# EAGLE board SPI_Test (EAGLE 9.6.2)
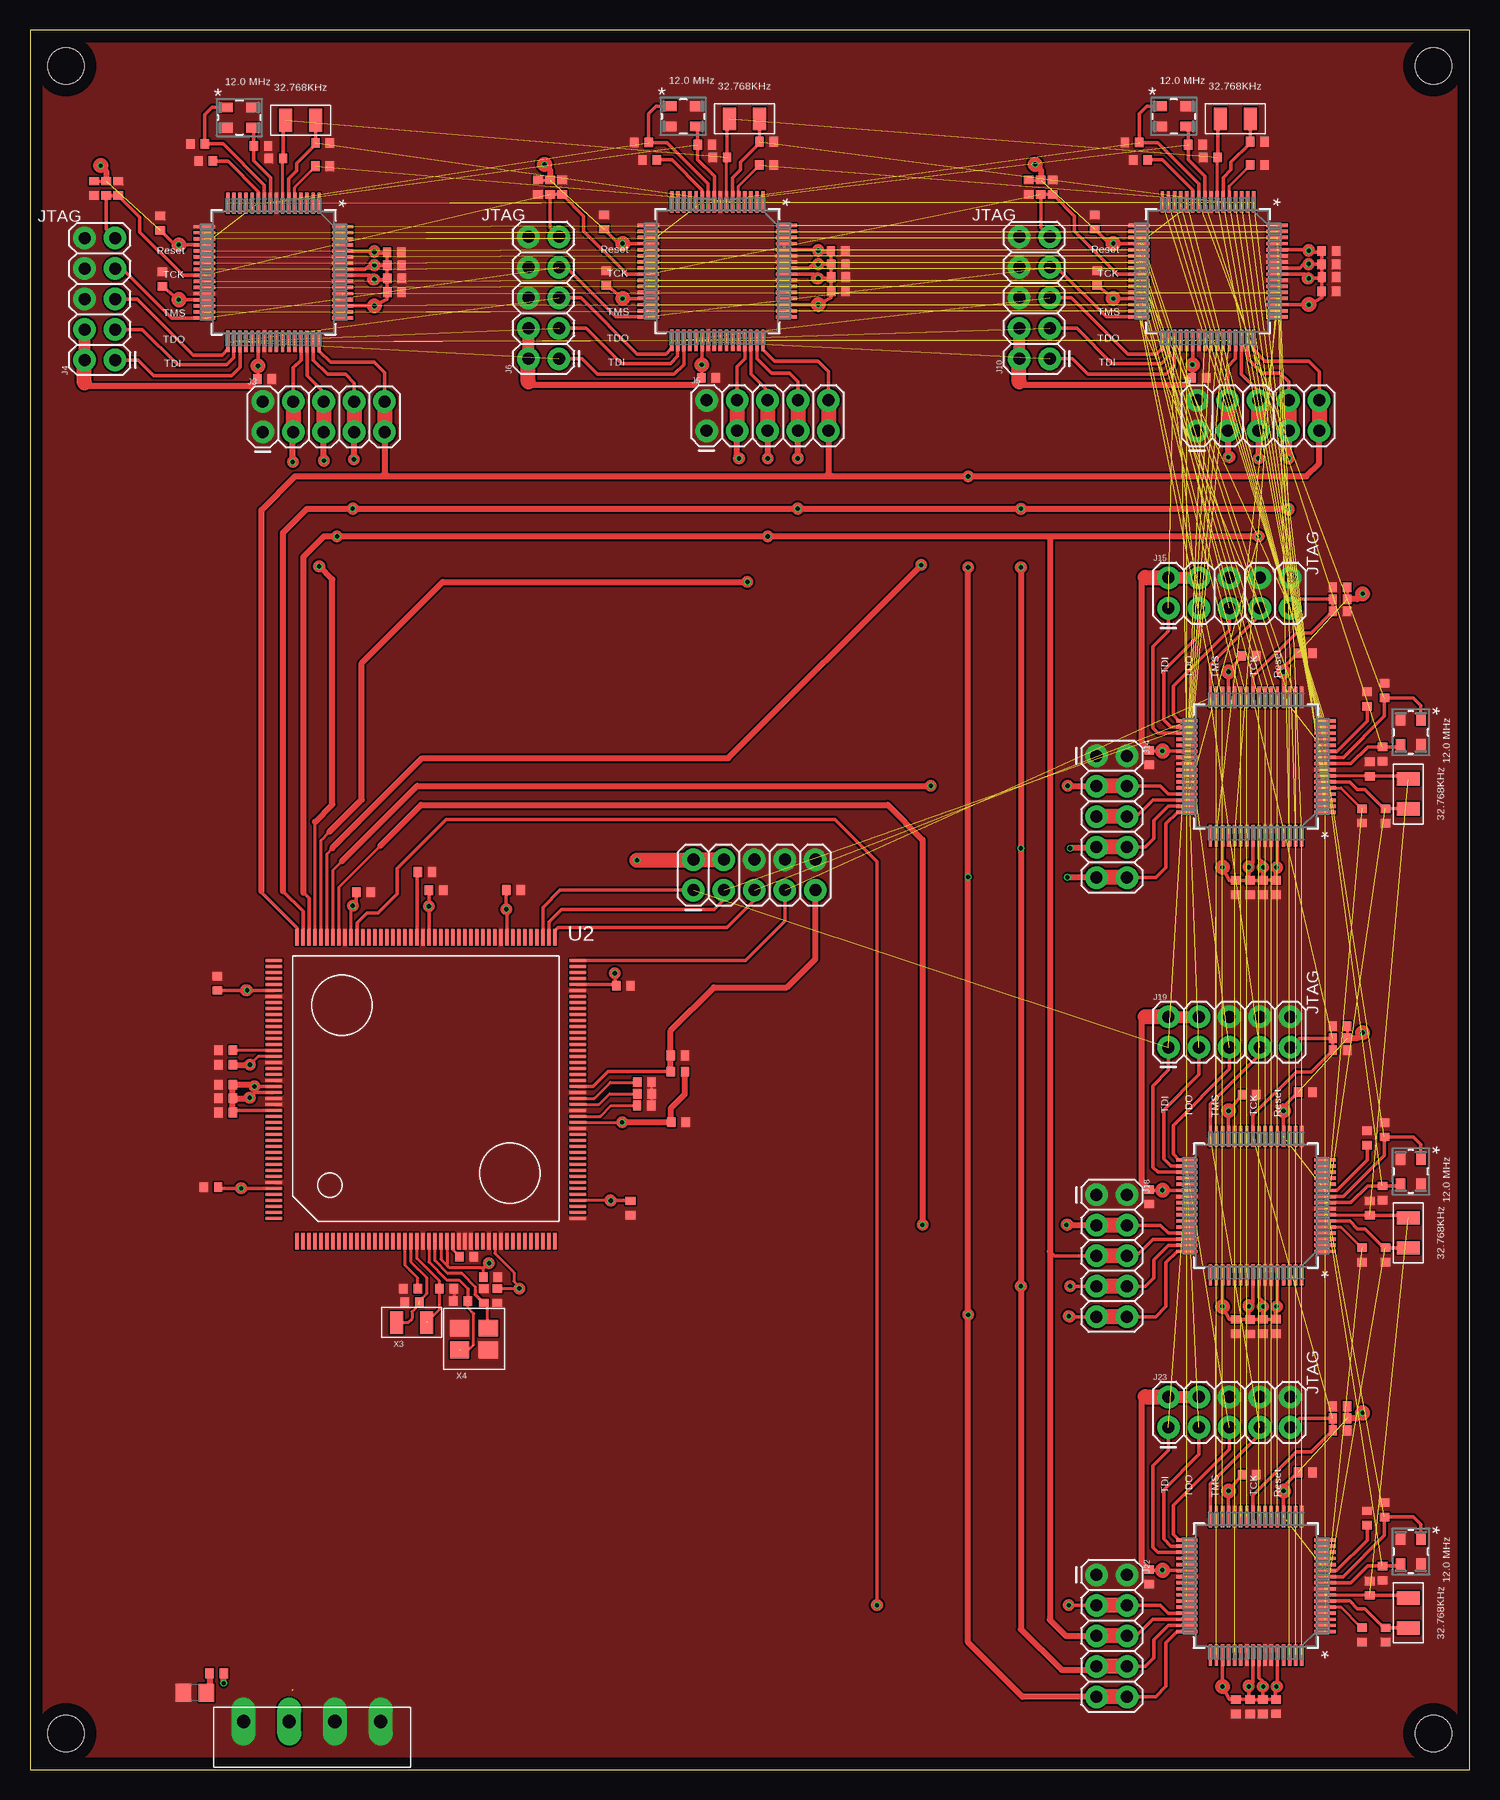
[diagram p6: board, top side]
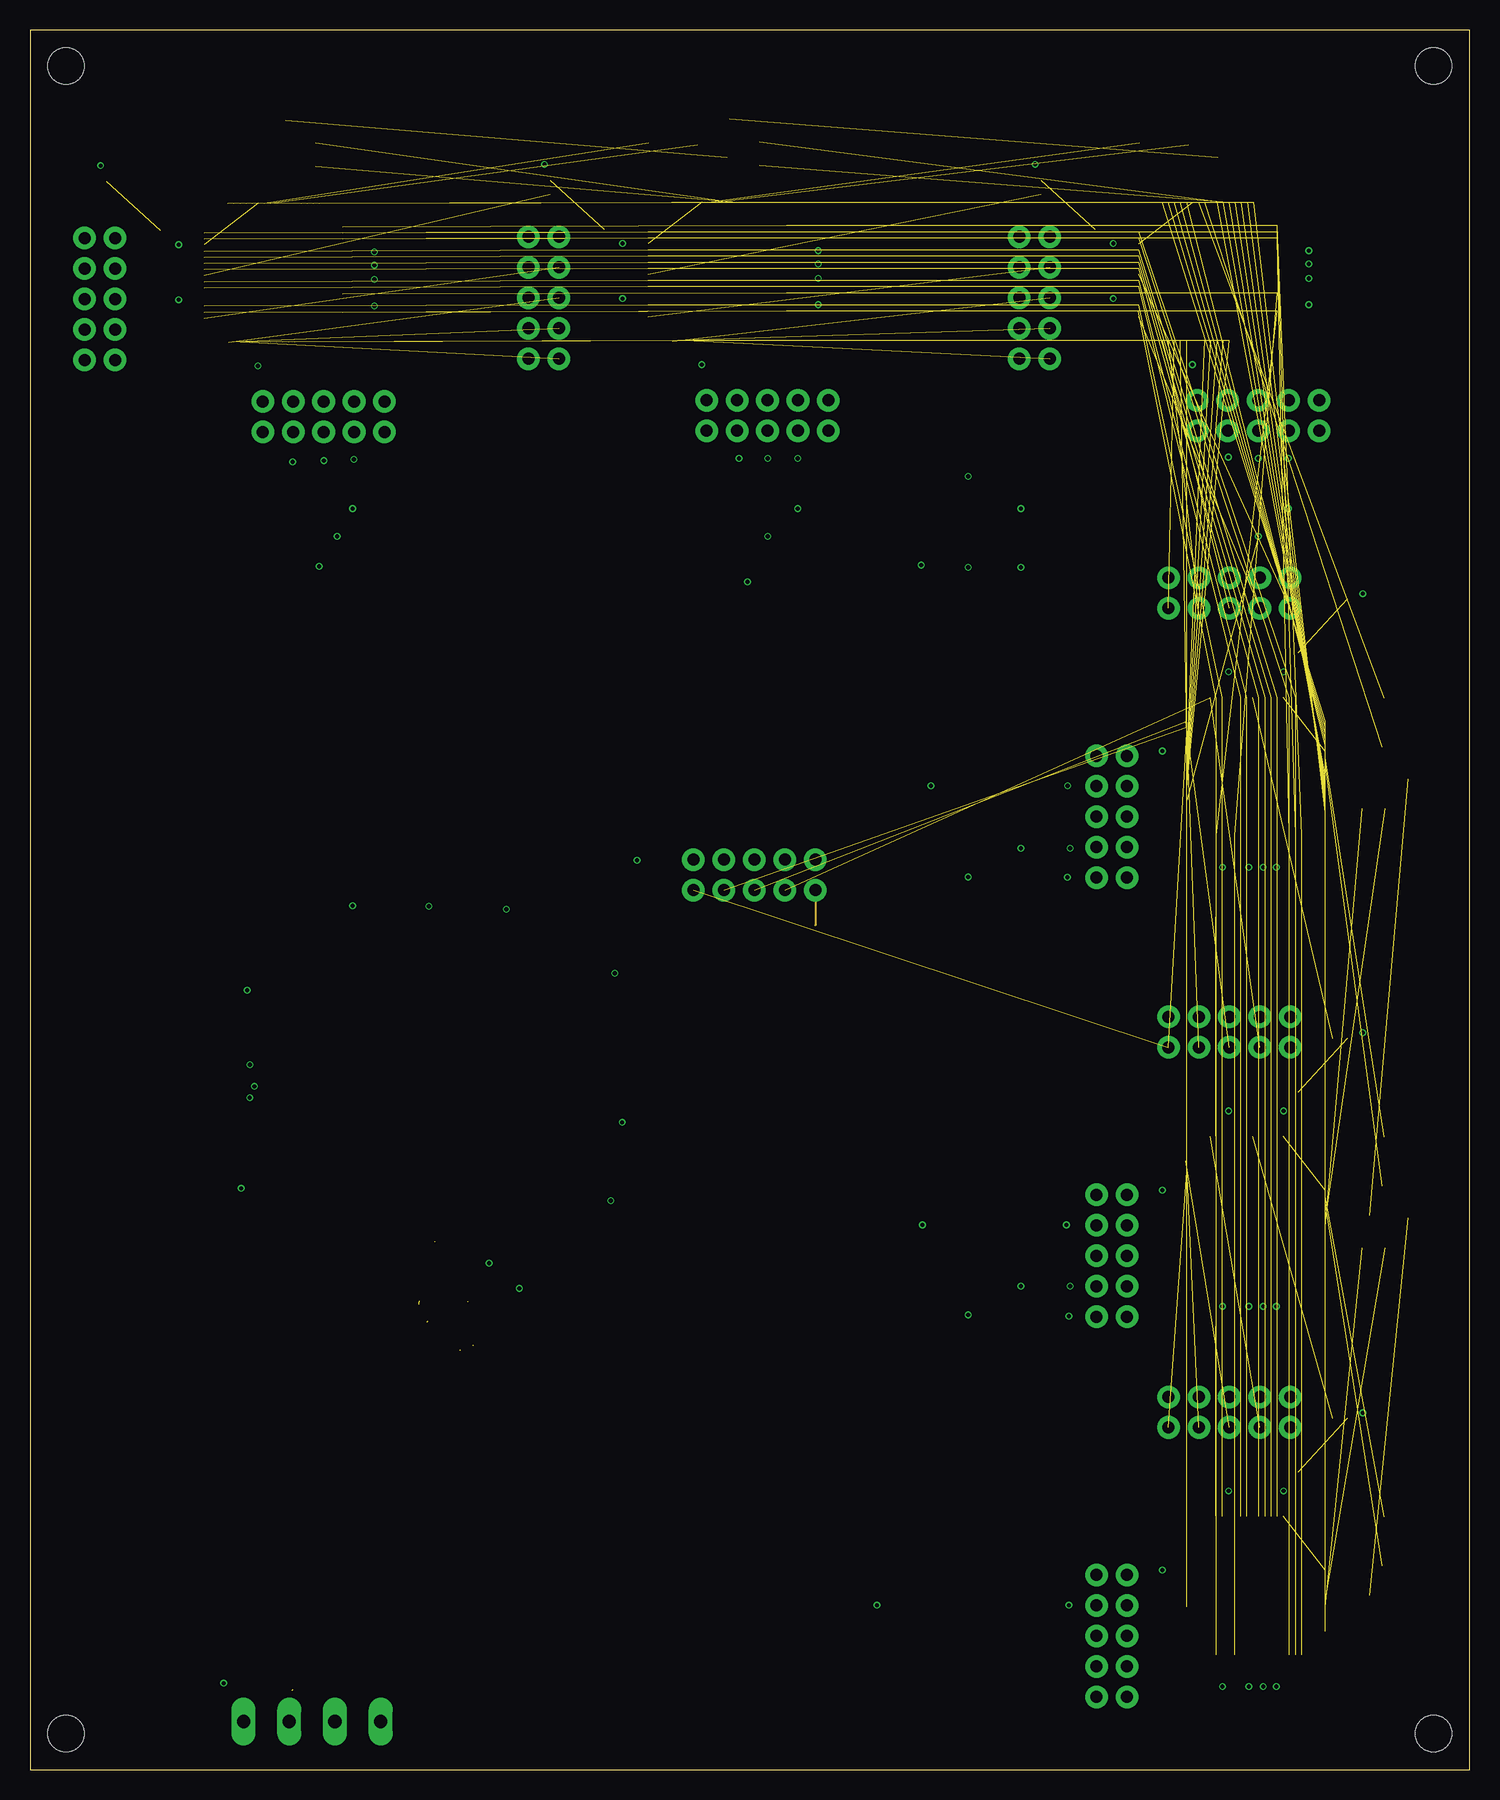
[diagram p7: board, inner layer Route3]
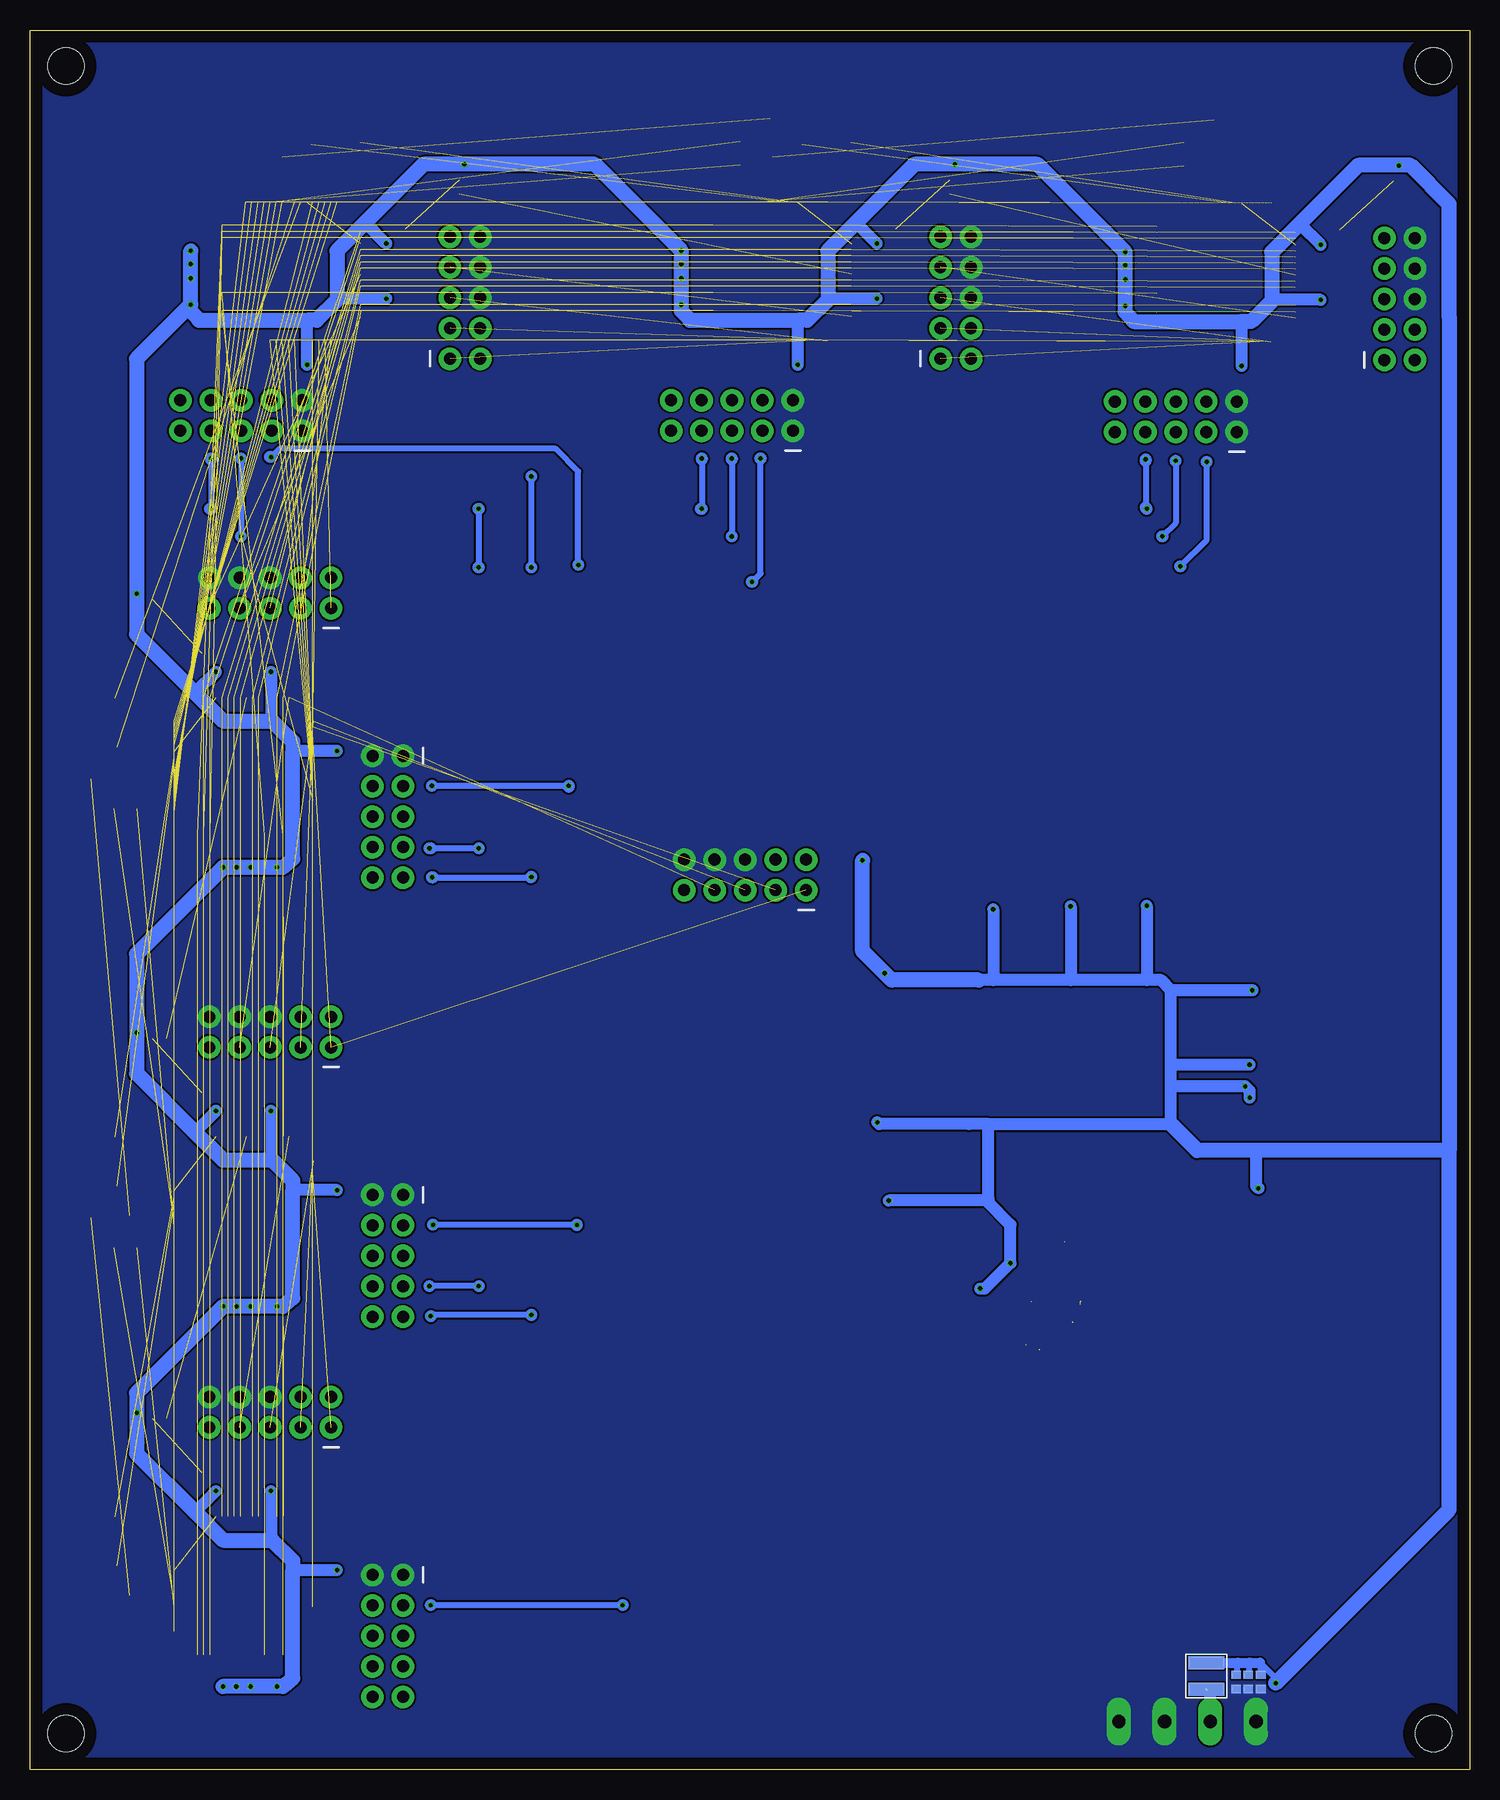
[diagram p8: board, bottom side, seen from below]

Size 120 x 145 mm. Coordinates in mm from the lower left corner, seen from the top.
Outline: 0,0 120,0 120,145 0,145 0,0
Copper layers (1*16): Top 0.035mm / dielectric 1.5mm / Bottom 0.035mm
Design rules "default": minimum track width 6mil, minimum drill 0.2mm, track to track 6mil, track to pad 6mil, pad to pad 6mil, via to via 6mil, smd to smd 6mil, copper to edge 40mil, drill to drill 6mil, minimum pad ring 10mil, minimum via ring 4mil, stop-mask expansion 4mil, vias tented up to drill 0mil, thermal gap 10mil
Holes 3 mm at 3,3 117,3 117,142 3,142

## Footprints (pad centres in the part's own frame; a part is rotated, then mirrored left to right if it is on the bottom)
0402 = smd 0.8 x 0.7: P$1 0,0.6; P$2 0,-0.6
2X5 = drill 1 pad 1.88: 1 0,0; 2 0,2.54; 3 2.54,0; 4 2.54,2.54; 5 5.08,0; 6 5.08,2.54; 7 7.62,0; 8 7.62,2.54; 9 10.16,0; 10 10.16,2.54
1X4_3.81MM_PITCH = drill 1.1 pad 2 long: P$1 0,0; P$2 3.81,0; P$3 7.62,0; P$4 11.43,0
1008 = smd 3 x 1.1: 1 0,1.1; 2 0,-1.1
0805 = smd 1.3 x 1.5: 1 -0.95,0; 2 0.95,0
PLQP0064KB-C_REN-M = smd 1.778 x 0.279: 1 -5.766,3.81; 2 -5.766,3.302; 3 -5.766,2.794; 4 -5.766,2.286; 5 -5.766,1.778; 6 -5.766,1.27; 7 -5.766,0.762; 8 -5.766,0.254; 9 -5.766,-0.254; 10 -5.766,-0.762; 11 -5.766,-1.27; 12 -5.766,-1.778; 13 -5.766,-2.286; 14 -5.766,-2.794; 15 -5.766,-3.302; 16 -5.766,-3.81; 33 5.766,-3.81; 34 5.766,-3.302; 35 5.766,-2.794; 36 5.766,-2.286; 37 5.766,-1.778; 38 5.766,-1.27; 39 5.766,-0.762; 40 5.766,-0.254; 41 5.766,0.254; 42 5.766,0.762; 43 5.766,1.27; 44 5.766,1.778; 45 5.766,2.286; 46 5.766,2.794; 47 5.766,3.302; 48 5.766,3.81 | smd 0.279 x 1.778: 17 -3.81,-5.766; 18 -3.302,-5.766; 19 -2.794,-5.766; 20 -2.286,-5.766; 21 -1.778,-5.766; 22 -1.27,-5.766; 23 -0.762,-5.766; 24 -0.254,-5.766; 25 0.254,-5.766; 26 0.762,-5.766; 27 1.27,-5.766; 28 1.778,-5.766; 29 2.286,-5.766; 30 2.794,-5.766; 31 3.302,-5.766; 32 3.81,-5.766; 49 3.81,5.766; 50 3.302,5.766; 51 2.794,5.766; 52 2.286,5.766; 53 1.778,5.766; 54 1.27,5.766; 55 0.762,5.766; 56 0.254,5.766; 57 -0.254,5.766; 58 -0.762,5.766; 59 -1.27,5.766; 60 -1.778,5.766; 61 -2.286,5.766; 62 -2.794,5.766; 63 -3.302,5.766; 64 -3.81,5.766
LQFP176_24X24 = smd 1.372 x 0.254: 1 -12.675,10.75; 2 -12.675,10.25; 3 -12.675,9.75; 4 -12.675,9.25; 5 -12.675,8.75; 6 -12.675,8.25; 7 -12.675,7.75; 8 -12.675,7.25; 9 -12.675,6.75; 10 -12.675,6.25; 11 -12.675,5.75; 12 -12.675,5.25; 13 -12.675,4.75; 14 -12.675,4.25; 15 -12.675,3.75; 16 -12.675,3.25; 17 -12.675,2.75; 18 -12.675,2.25; 19 -12.675,1.75; 20 -12.675,1.25; 21 -12.675,0.75; 22 -12.675,0.25; 23 -12.675,-0.25; 24 -12.675,-0.75; 25 -12.675,-1.25; 26 -12.675,-1.75; 27 -12.675,-2.25; 28 -12.675,-2.75; 29 -12.675,-3.25; 30 -12.675,-3.75; 31 -12.675,-4.25; 32 -12.675,-4.75; 33 -12.675,-5.25; 34 -12.675,-5.75; 35 -12.675,-6.25; 36 -12.675,-6.75; 37 -12.675,-7.25; 38 -12.675,-7.75; 39 -12.675,-8.25; 40 -12.675,-8.75; 41 -12.675,-9.25; 42 -12.675,-9.75; 43 -12.675,-10.25; 44 -12.675,-10.75; 89 12.675,-10.75; 90 12.675,-10.25; 91 12.675,-9.75; 92 12.675,-9.25; 93 12.675,-8.75; 94 12.675,-8.25; 95 12.675,-7.75; 96 12.675,-7.25; 97 12.675,-6.75; 98 12.675,-6.25; 99 12.675,-5.75; 100 12.675,-5.25; 101 12.675,-4.75; 102 12.675,-4.25; 103 12.675,-3.75; 104 12.675,-3.25; 105 12.675,-2.75; 106 12.675,-2.25; 107 12.675,-1.75; 108 12.675,-1.25; 109 12.675,-0.75; 110 12.675,-0.25; 111 12.675,0.25; 112 12.675,0.75; 113 12.675,1.25; 114 12.675,1.75; 115 12.675,2.25; 116 12.675,2.75; 117 12.675,3.25; 118 12.675,3.75; 119 12.675,4.25; 120 12.675,4.75; 121 12.675,5.25; 122 12.675,5.75; 123 12.675,6.25; 124 12.675,6.75; 125 12.675,7.25; 126 12.675,7.75; 127 12.675,8.25; 128 12.675,8.75; 129 12.675,9.25; 130 12.675,9.75; 131 12.675,10.25; 132 12.675,10.75 | smd 0.254 x 1.372: 45 -10.75,-12.675; 46 -10.25,-12.675; 47 -9.75,-12.675; 48 -9.25,-12.675; 49 -8.75,-12.675; 50 -8.25,-12.675; 51 -7.75,-12.675; 52 -7.25,-12.675; 53 -6.75,-12.675; 54 -6.25,-12.675; 55 -5.75,-12.675; 56 -5.25,-12.675; 57 -4.75,-12.675; 58 -4.25,-12.675; 59 -3.75,-12.675; 60 -3.25,-12.675; 61 -2.75,-12.675; 62 -2.25,-12.675; 63 -1.75,-12.675; 64 -1.25,-12.675; 65 -0.75,-12.675; 66 -0.25,-12.675; 67 0.25,-12.675; 68 0.75,-12.675; 69 1.25,-12.675; 70 1.75,-12.675; 71 2.25,-12.675; 72 2.75,-12.675; 73 3.25,-12.675; 74 3.75,-12.675; 75 4.25,-12.675; 76 4.75,-12.675; 77 5.25,-12.675; 78 5.75,-12.675; 79 6.25,-12.675; 80 6.75,-12.675; 81 7.25,-12.675; 82 7.75,-12.675; 83 8.25,-12.675; 84 8.75,-12.675; 85 9.25,-12.675; 86 9.75,-12.675; 87 10.25,-12.675; 88 10.75,-12.675; 133 10.75,12.675; 134 10.25,12.675; 135 9.75,12.675; 136 9.25,12.675; 137 8.75,12.675; 138 8.25,12.675; 139 7.75,12.675; 140 7.25,12.675; 141 6.75,12.675; 142 6.25,12.675; 143 5.75,12.675; 144 5.25,12.675; 145 4.75,12.675; 146 4.25,12.675; 147 3.75,12.675; 148 3.25,12.675; 149 2.75,12.675; 150 2.25,12.675; 151 1.75,12.675; 152 1.25,12.675; 153 0.75,12.675; 154 0.25,12.675; 155 -0.25,12.675; 156 -0.75,12.675; 157 -1.25,12.675; 158 -1.75,12.675; 159 -2.25,12.675; 160 -2.75,12.675; 161 -3.25,12.675; 162 -3.75,12.675; 163 -4.25,12.675; 164 -4.75,12.675; 165 -5.25,12.675; 166 -5.75,12.675; 167 -6.25,12.675; 168 -6.75,12.675; 169 -7.25,12.675; 170 -7.75,12.675; 171 -8.25,12.675; 172 -8.75,12.675; 173 -9.25,12.675; 174 -9.75,12.675; 175 -10.25,12.675; 176 -10.75,12.675
SMD_X_2_PADS = smd 1.9 x 1.1: P$1 0,1.25; P$2 0,-1.25
SMD_3225 = smd 1.6 x 1.4: 1 -1.2,-0.9; 2 1.2,-0.9; 3 1.2,0.9; 4 -1.2,0.9
CRYSTAL_ABM8G_ABR = smd 0.991 x 0.813: 1 -1.054,0.85; 2 -1.054,-0.85; 3 1.054,-0.85; 4 1.054,0.85

## Placement (x,y rotation side)
C1  0.1uF  [0402]  33.86,73.28 270 top
C2  0.1uF  [0402]  40.31,73.31 270 top
C3  0.1uF  [0402]  27.82,73.13 270 top
C4  0.1uF  [0402]  15.09,48.55 90 top
C5  0.1uF  [0402]  51.2,55.35 90 top
C6  1uF  [0402]  49.46,65.34 90 top
C7  0.1uF  [0402]  32.92,74.81 270 top
C8  0.1uF  [0402]  16.3,59.94 90 top
C9  0.1uF  [0402]  31.72,40.07 270 top
C10  12pF  [0402]  31.84,38.97 270 top
C11  12pF  [0402]  34.73,40.07 90 top
C12  18pF  [0402]  35.9,39.03 270 top
C13  18pF  [0402]  37.83,39.5 180 top
C14  0.1uF  [0402]  15.61,65.54 0 top
C15  0.1uF  [0402]  16.3,54.77 90 top
C19  0.1uF  [0402]  17.4,7.3 0 bottom
C20  0.1uF  [0402]  19.45,7.3 0 bottom
C21  10uF  [0402]  18.45,7.3 0 bottom
C23  0.1uF  [0402]  16.3,58.75 90 top
C26  10uF  [0402]  54,59.52 90 top
C28  0.1uF  [0402]  38.39,41.06 90 top
C29  0.1uF  [0402]  54.05,53.96 90 top
C31  0.1uF  [0402]  38.97,39.5 0 top
C39  12pF  [0402]  24.41,135.59 90 top
C40  12pF  [0402]  20.5,134.29 270 top
C41  10pF  [0402]  19.25,135.34 90 top
C42  10pF  [0402]  13.97,135.51 270 top
C43  0.1uF  [0402]  19.55,115.9 90 top
C44  0.1uF  [0402]  50.06,46.79 180 top
C45  0.1uF  [0402]  16.3,57.09 90 top
C46  1uF  [0402]  16.3,55.95 90 top
C47  0.1uF  [0402]  10.85,128.9 180 top
C48  0.1uF  [0402]  30.38,123.12 90 top
C49  0.1uF  [0402]  5.35,131.8 0 top
C50  0.1uF  [0402]  24.4,133.65 270 top
C51  0.1uF  [0402]  14.66,134.07 90 top
C52  0.1uF  [0402]  30.39,124.3 90 top
C53  0.1uF  [0402]  30.38,125.37 90 top
C54  0.1uF  [0402]  11.05,124.22 180 top
C55  1uF  [0402]  30.37,126.47 90 top
C56  10uF  [0402]  7.35,131.8 180 top
C57  12pF  [0402]  61.41,135.69 90 top
C58  12pF  [0402]  57.5,134.39 270 top
C59  10pF  [0402]  56.25,135.44 90 top
C60  10pF  [0402]  50.97,135.61 270 top
C61  0.1uF  [0402]  56.55,116 90 top
C62  0.1uF  [0402]  47.85,129 180 top
C63  0.1uF  [0402]  67.38,123.22 90 top
C64  0.1uF  [0402]  42.35,131.9 0 top
C65  0.1uF  [0402]  61.4,133.75 270 top
C66  0.1uF  [0402]  51.66,134.17 90 top
C67  0.1uF  [0402]  67.39,124.4 90 top
C68  0.1uF  [0402]  67.38,125.47 90 top
C69  0.1uF  [0402]  48.05,124.32 180 top
C70  1uF  [0402]  67.37,126.57 90 top
C71  10uF  [0402]  44.35,131.9 180 top
C87  12pF  [0402]  102.31,135.69 90 top
C88  12pF  [0402]  98.4,134.39 270 top
C89  10pF  [0402]  97.15,135.44 90 top
C90  10pF  [0402]  91.87,135.61 270 top
C91  0.1uF  [0402]  97.45,116 90 top
C92  0.1uF  [0402]  88.75,129 180 top
C93  0.1uF  [0402]  108.28,123.22 90 top
C94  0.1uF  [0402]  83.25,131.9 0 top
C95  0.1uF  [0402]  102.3,133.75 270 top
C96  0.1uF  [0402]  92.56,134.17 90 top
C97  0.1uF  [0402]  108.29,124.4 90 top
C98  0.1uF  [0402]  108.28,125.47 90 top
C99  0.1uF  [0402]  88.95,124.32 180 top
C100  1uF  [0402]  108.27,126.57 90 top
C101  10uF  [0402]  85.25,131.9 180 top
C117  12pF  [0402]  112.99,79.49 0 top
C118  12pF  [0402]  111.69,83.4 180 top
C119  10pF  [0402]  112.74,84.65 0 top
C120  10pF  [0402]  112.91,89.93 180 top
C121  0.1uF  [0402]  93.3,84.35 0 top
C122  0.1uF  [0402]  106.3,93.05 90 top
C123  0.1uF  [0402]  100.52,73.52 0 top
C124  0.1uF  [0402]  109.2,98.55 270 top
C125  0.1uF  [0402]  111.05,79.5 180 top
C126  0.1uF  [0402]  111.47,89.24 0 top
C127  0.1uF  [0402]  101.7,73.51 0 top
C128  0.1uF  [0402]  102.77,73.52 0 top
C129  0.1uF  [0402]  101.62,92.85 90 top
C130  1uF  [0402]  103.87,73.53 0 top
C131  10uF  [0402]  109.2,96.55 90 top
C147  12pF  [0402]  112.99,42.89 0 top
C148  12pF  [0402]  111.69,46.8 180 top
C149  10pF  [0402]  112.74,48.05 0 top
C150  10pF  [0402]  112.91,53.33 180 top
C151  0.1uF  [0402]  93.3,47.75 0 top
C152  0.1uF  [0402]  106.3,56.45 90 top
C153  0.1uF  [0402]  100.52,36.92 0 top
C154  0.1uF  [0402]  109.2,61.95 270 top
C155  0.1uF  [0402]  111.05,42.9 180 top
C156  0.1uF  [0402]  111.47,52.64 0 top
C157  0.1uF  [0402]  101.7,36.91 0 top
C158  0.1uF  [0402]  102.77,36.92 0 top
C159  0.1uF  [0402]  101.62,56.25 90 top
C160  1uF  [0402]  103.87,36.93 0 top
C161  10uF  [0402]  109.2,59.95 90 top
C177  12pF  [0402]  112.99,11.21 0 top
C178  12pF  [0402]  111.69,15.12 180 top
C179  10pF  [0402]  112.74,16.37 0 top
C180  10pF  [0402]  112.91,21.65 180 top
C181  0.1uF  [0402]  93.3,16.07 0 top
C182  0.1uF  [0402]  106.3,24.77 90 top
C183  0.1uF  [0402]  100.52,5.24 0 top
C184  0.1uF  [0402]  109.2,30.27 270 top
C185  0.1uF  [0402]  111.05,11.22 180 top
C186  0.1uF  [0402]  111.47,20.96 0 top
C187  0.1uF  [0402]  101.7,5.23 0 top
C188  0.1uF  [0402]  102.77,5.24 0 top
C189  0.1uF  [0402]  101.62,24.57 90 top
C190  1uF  [0402]  103.87,5.25 0 top
C191  10uF  [0402]  109.2,28.27 90 top
J1  10-pos  [2X5]  55.3,73.3 0 top
J3  [2X5]  19.4,111.5 0 top
J4  10-pos  [2X5]  7.1,117.5 90 top
J5  [2X5]  56.4,111.6 0 top
J6  10-pos  [2X5]  44.1,117.6 90 top
J9  [2X5]  97.3,111.6 0 top
J10  10-pos  [2X5]  85,117.6 90 top
J13  4-pos  [1X4_3.81MM_PITCH]  17.8,4 0 top
J14  [2X5]  88.9,84.5 270 top
J15  10-pos  [2X5]  94.9,96.8 0 top
J18  [2X5]  88.9,47.9 270 top
J19  10-pos  [2X5]  94.9,60.2 0 top
J22  [2X5]  88.9,16.22 270 top
J23  10-pos  [2X5]  94.9,28.52 0 top
L2  2.2uH  [1008]  21.95,7.8 180 bottom
LED2  Green  [0805]  13.75,6.4 180 top
R1  10K0  [0402]  51.21,57.28 270 top
R2  10K0  [0402]  51.22,56.32 270 top
R3  10K0  [0402]  54,58.17 90 top
R4  2K2  [0402]  36.41,42.75 270 top
R5  10K0  [0402]  6.35,131.8 180 top
R6  10K0  [0402]  43.35,131.9 180 top
R8  10K0  [0402]  84.25,131.9 180 top
R10  10K0  [0402]  109.2,97.55 90 top
R12  470R0  [0402]  15.56,8.02 90 top
R13  10K0  [0402]  109.2,60.95 90 top
R15  10K0  [0402]  109.2,29.27 90 top
U1  RENESAS_R7FS5D37A3A01CFM#AA0PLQP0064KB-C_REN-M  [PLQP0064KB-C_REN-M]  20.3,124.8 270 top
U2  S7G2LQFP176  [LQFP176_24X24]  33,56.7 90 top
U3  RENESAS_R7FS5D37A3A01CFM#AA0PLQP0064KB-C_REN-M  [PLQP0064KB-C_REN-M]  57.3,124.9 270 top
U6  RENESAS_R7FS5D37A3A01CFM#AA0PLQP0064KB-C_REN-M  [PLQP0064KB-C_REN-M]  98.2,124.9 270 top
U8  RENESAS_R7FS5D37A3A01CFM#AA0PLQP0064KB-C_REN-M  [PLQP0064KB-C_REN-M]  102.2,83.6 180 top
U10  RENESAS_R7FS5D37A3A01CFM#AA0PLQP0064KB-C_REN-M  [PLQP0064KB-C_REN-M]  102.2,47 180 top
U12  RENESAS_R7FS5D37A3A01CFM#AA0PLQP0064KB-C_REN-M  [PLQP0064KB-C_REN-M]  102.2,15.32 180 top
X2  32.768KHz  [SMD_X_2_PADS]  22.57,137.49 270 top
X3  32.768KHz  [SMD_X_2_PADS]  31.8,37.26 90 top
X4  24MHz  [SMD_3225]  37.01,35.89 0 top
X5  32.768KHz  [SMD_X_2_PADS]  59.57,137.59 270 top
X7  32.768KHz  [SMD_X_2_PADS]  100.47,137.59 270 top
X9  32.768KHz  [SMD_X_2_PADS]  114.89,81.33 180 top
X11  32.768KHz  [SMD_X_2_PADS]  114.89,44.73 180 top
X13  32.768KHz  [SMD_X_2_PADS]  114.89,13.05 180 top
Y1  XTAL_12MHZ_ABM8G-12.000MHZ-B4Y-T  [CRYSTAL_ABM8G_ABR]  17.45,137.7 0 top
Y3  XTAL_12MHZ_ABM8G-12.000MHZ-B4Y-T  [CRYSTAL_ABM8G_ABR]  54.45,137.8 0 top
Y5  XTAL_12MHZ_ABM8G-12.000MHZ-B4Y-T  [CRYSTAL_ABM8G_ABR]  95.35,137.8 0 top
Y7  XTAL_12MHZ_ABM8G-12.000MHZ-B4Y-T  [CRYSTAL_ABM8G_ABR]  115.1,86.45 270 top
Y9  XTAL_12MHZ_ABM8G-12.000MHZ-B4Y-T  [CRYSTAL_ABM8G_ABR]  115.1,49.85 270 top
Y11  XTAL_12MHZ_ABM8G-12.000MHZ-B4Y-T  [CRYSTAL_ABM8G_ABR]  115.1,18.17 270 top

## Tracks (layer width: path | path; a pad name or v marks a point on that pad's centre or on a via)
DFI_01_A1  (5 unrouted)
DFI_02_A1  (5 unrouted)
DFO_01_A1  (5 unrouted)
DFO_02_A1  (5 unrouted)
DFO_03_A1  (5 unrouted)
DIR_M0A1  (5 unrouted)
DIR_M1A1  (5 unrouted)
ENABLE_M0A1  (5 unrouted)
ENABLE_M1A1  (5 unrouted)
ESTOP_A1  (5 unrouted)
GND
  Top 0.2: C5.P$2 51.82,55.37 R2.P$1 R1.P$1 51.84,57.3 | C45.P$1 15.75,57.04 | 15.71,55.9 C46.P$1 | U2.156 20.34,55.97 | C13.P$2 37.8,40.13 | X4.2 38.42,35.2 | 35.33,39.06 C12.P$2 | C9.P$2 31.05,40
  Top 0.254: C11.P$2 35.33,39.06
  pour Bottom (no thermals): 0,145 120,145 120,0 0,0
  pour Top (no thermals): 0,145 120,145 120,0 0,0
HLFB_M0A1  (5 unrouted)
HLFB_M1A1  (5 unrouted)
LS_01_A1  (5 unrouted)
  Top 0.15: U1.23 | U3.23 | U6.23 | U8.23 | U10.23 | U12.23
LS_02_A1  (5 unrouted)
  Top 0.15: U1.53 | U3.53 | U6.53 | U8.53 | U10.53 | U12.53
LS_03_A1  (5 unrouted)
LS_04_A1  (5 unrouted)
MISO  (via drill 0.35)
  Top 0.305: U1.48 24.11,118.23 25.04,117.3 28.7,117.3 29.56,116.44 J3.10 | U3.48 61.11,118.33 62.04,117.4 65.7,117.4 66.56,116.54 J5.10 | U6.48 102.01,118.33 102.94,117.4 106.6,117.4 107.46,116.54 J9.10 | U8.48 95.63,79.79 94.7,78.86 94.7,75.2 93.84,74.34 J14.10 | U10.48 95.63,43.19 94.7,42.26 94.7,38.6 93.84,37.74 J18.10 | U12.48 95.63,11.51 94.7,10.58 94.7,6.92 93.84,6.06 J22.10 | U2.132 22.25,70.15 19.3,73.1 19.3,73.2 | 86.66,37.74 J18.9
  Top 0.508: 19.3,73.2 19.3,105 22.1,107.8 29.8,107.8 | 29.8,107.8 66.8,107.8 | 66.8,107.8 v78.2,107.8 106.4,107.8 107.46,108.86 J9.9 | J5.9 66.56,108.04 66.8,107.8 | J3.9 29.56,108.04 29.8,107.8 | J22.9 82.74,6.06 78.2,10.6 v78.2,37.9 v78.2,74.4 v78.2,100.2 | J14.9 86.51,74.34 v86.48,74.37
  Top 1.016: v78.2,100.2 v78.21,100.2 | v78.2,107.8 v78.2,107.79 | v78.2,37.9 v78.21,37.9 | v86.6,37.8 86.66,37.74
  Top 1.27: J3.10 J3.9 | J5.10 J5.9 | J9.10 J9.9 | J14.10 J14.9 | J18.10 J18.9 | J22.10 J22.9
  Bottom 0.508: v78.2,100.2 v78.2,107.8 | v78.2,37.9 86.5,37.9 v86.6,37.8 | 86.4,74.37 78.23,74.37
  Bottom 1.016: v78.2,107.8 v78.21,107.8 | v78.2,100.2 v78.21,100.2 | v86.6,37.8 v86.6,37.81 | v78.2,74.4 78.23,74.37 | v86.48,74.37 86.4,74.37 | v78.2,37.9 v78.2,37.89
MOSI  (via drill 0.35)
  Top 0.305: U1.47 23.6,117.5 24.8,116.3 26.3,116.3 27.02,115.58 J3.8 | U3.47 60.6,117.6 61.8,116.4 63.3,116.4 64.02,115.68 J5.8 | U6.47 101.5,117.6 102.7,116.4 104.2,116.4 104.92,115.68 J9.8 | U8.47 94.9,80.3 93.7,79.1 93.7,77.6 92.98,76.88 J14.8 | U10.47 94.9,43.7 93.7,42.5 93.7,41 92.98,40.28 J18.8 | U12.47 94.9,12.02 93.7,10.82 93.7,9.32 92.98,8.6 J22.8 | U2.131 22.75,71.55 21.1,73.2 | 86.72,40.28 J18.7
  Top 0.508: 21.1,73.2 21.1,103.1 23.1,105.1 v26.9,105.1 v64,105.1 v82.6,105.1 | v82.61,105.1 v104.9,105.1 105.1,105.1 | J9.7 104.92,109.32 v104.9,109.3 | 64.02,109.32 J5.7 | 27.02,109.22 J3.7 | v82.6,100.2 v82.6,76.8 v82.6,40.3 82.6,11.7 86,8.3 88.6,8.3 J22.7 | J14.7 88.82,76.8 v86.7,76.8
  Top 1.016: v26.9,105.1 v26.9,105.11 | v64,105.1 v64,105.11 | v104.9,105.1 104.9,105 | v104.9,109.3 v104.91,109.3 | v64,109.3 64.02,109.32 | v27,109.2 27.02,109.22 | v82.6,100.2 v82.61,100.2 | v82.6,105.1 v82.61,105.1 | v82.6,40.3 v82.61,40.3 | v86.7,40.3 86.72,40.28
  Top 1.27: J3.8 J3.7 | J5.8 J5.7 | J9.8 J9.7 | J14.8 J14.7 | J18.8 J18.7 | J22.8 J22.7
  Bottom 0.508: 104.9,109.2 v104.9,105.1 | 64,109.2 v64,105.1 | 27,109.1 27,105.2 | v82.6,105.1 v82.6,100.2 | v82.6,40.3 v86.7,40.3 | 86.6,76.8 v82.6,76.8
  Bottom 1.016: v64,109.3 64,109.2 | v64,105.1 64.1,105.1 | v26.9,105.1 27,105.2 | v27,109.2 27,109.1 | v104.9,109.3 104.9,109.2 | v104.9,105.1 105,105.1 | v82.6,105.1 v82.61,105.1 | v82.6,100.2 v82.61,100.2 | v82.6,40.3 v82.6,40.29 | v86.7,40.3 v86.7,40.29 | v86.7,76.8 86.6,76.8 | v82.6,76.8 v82.6,76.79
N$2
  Top 0.254: U2.148 18.45,59.95 18.44,59.94 C8.P$2
N$3
  Top 0.254: C9.P$1 32.32,40.97 31.25,42.05 U2.19
N$4
  Top 0.508: R12.P$1 14.96,6.66 LED2.1
N$9
  Top 0.254: U2.62 47.55,54.45 48.45,55.35 C5.P$1
N$10
  Top 0.254: U2.64 47.45,55.45 48.32,56.32 R2.P$2
N$11
  Top 0.2: 45.9,55.95 U2.65
  Top 0.254: U2.65 47.05,55.95 48.38,57.27 R1.P$2
N$12
  Top 0.254: U2.27 35.25,43.31 R4.P$2
N$69  (5 unrouted)
N$70  (5 unrouted)
N$76  (5 unrouted)
N$82  (5 unrouted)
N$83  (5 unrouted)
N$86  (5 unrouted)
N$89  (5 unrouted)
N$90  (5 unrouted)
P5_05
  Top 0.2: U2.145
RELAY_1_A1  (5 unrouted)
RELAY_2_A1  (5 unrouted)
RELAY_3_A1  (5 unrouted)
RELAY_4_A1  (5 unrouted)
  Top 0.15: U1.31 14.49,121.46 | U3.31 51.49,121.56 | U6.31 92.39,121.56 | U8.31 98.86,89.41 | U10.31 98.86,52.81 | U12.31 98.86,21.13
RESET
  Top 0.305: U2.67 46.95,56.95 48.17,58.17 R3.P$1
  Top 0.508: R3.P$1 C26.P$1 53.4,61.6 57,65.2 63.1,65.2 65.46,67.56 J1.9
  Route3 0.15: J1.9 65.46,70.36
RESET_A1  (5 unrouted)
  Top 0.305: U1.25 12.75,124.55 9.15,128.15 9.15,129.4 C56.P$1 R5.P$1 6.35,128.41 J4.9 | U3.25 49.75,124.65 46.15,128.25 46.15,129.5 C71.P$1 R6.P$1 43.35,128.51 J6.9 | U6.25 90.65,124.65 87.05,128.25 87.05,129.5 C101.P$1 R8.P$1 84.25,128.51 J10.9 | U8.25 101.95,91.15 105.55,94.75 106.8,94.75 C131.P$1 R10.P$1 105.81,97.55 J15.9 | U10.25 101.95,54.55 105.55,58.15 106.8,58.15 C161.P$1 R13.P$1 105.81,60.95 J19.9 | U12.25 101.95,22.87 105.55,26.47 106.8,26.47 C191.P$1 R15.P$1 105.81,29.27 J23.9
SCLK  (via drill 0.35)  (1 unrouted)
  Top 0.305: J3.6 24.48,114.82 23.09,116.21 U1.46 | J5.6 61.48,114.92 60.09,116.31 U3.46 | J9.6 102.38,114.92 100.99,116.31 U6.46 | J14.6 92.22,79.42 93.61,80.81 U8.46 | J18.6 92.22,42.82 93.61,44.21 U10.46 | J22.6 92.22,11.14 93.61,12.53 U12.46 | U2.130 23.25,72.65 22.8,73.1 | J18.5 85.38,42.82 85,43.2
  Top 0.508: 22.8,73.1 22.8,101.1 24.5,102.8 v25.6,102.8 v61.5,102.8 85,102.8 | 85,102.8 v102.4,102.8 102.7,102.8 | 85,102.8 85,43.2 85,12.5 86.36,11.14 J22.5 | J9.5 102.38,109.32 v102.4,109.3 | J5.5 61.48,109.32 v61.5,109.3 | 24.48,109.12 J3.5
  Top 1.016: v25.6,102.8 v25.6,102.81 | v61.5,102.8 v61.5,102.81 | v102.4,102.8 v102.4,102.79 | v102.4,109.3 v102.41,109.3 | v61.5,109.3 v61.51,109.3 | v24.5,109.1 24.48,109.12
  Top 1.27: J3.6 J3.5 | J5.6 J5.5 | J9.6 J9.5 | J14.6 J14.5 | J18.6 J18.5 | J22.6 J22.5
  Bottom 0.508: v102.4,109.3 v102.4,102.8 | 61.5,109.2 v61.5,102.8 | v24.5,109.1 24.5,103.9 v25.6,102.8
  Bottom 1.016: v61.5,109.3 61.5,109.2 | v61.5,102.8 v61.51,102.8 | v25.6,102.8 v25.61,102.8 | v24.5,109.1 v24.51,109.1 | v102.4,109.3 v102.41,109.3 | v102.4,102.8 v102.41,102.8
SSL0_A1_01  (via drill 0.35)
  Top 0.254: U2.129 23.75,79
  Top 0.305: J3.4 21.94,116.84 22.59,117.49 U1.45
  Top 0.508: v21.9,109 21.9,111.46 J3.3 | 23.75,79 25.2,80.45 25.2,99.2 v24.1,100.3
  Top 1.016: v21.9,109 v21.91,109 | v24.1,100.3 v24.11,100.3
  Top 1.27: J3.4 J3.3
  Bottom 0.508: v24.1,100.3 21.9,102.5 v21.9,109
  Bottom 1.016: v21.9,109 v21.91,109 | v24.1,100.3 v24.11,100.3
SSL0_A1_02  (via drill 0.35)
  Top 0.254: U2.128 24.25,77.45 24.95,78.15 25.7,78.9
  Top 0.305: U3.45 59.59,117.59 58.94,116.94 J5.4
  Top 0.508: 24.95,78.15 27.65,80.85 27.65,92.25 34.4,99 v59.8,99 | v59.1,109.3 58.94,109.46 J5.3
  Top 1.016: v59.8,99 v59.81,99 | v59.1,109.3 v59.11,109.3
  Top 1.27: J5.4 J5.3
  Bottom 0.508: v59.81,99 59.1,99.7 v59.1,109.3
  Bottom 1.016: v59.1,109.3 v59.11,109.3 | v59.81,99 v59.82,99
SSL0_A1_03  (via drill 0.35)
  Top 0.254: U2.127 24.75,76.33 25.2,76.78 25.2,76.8
  Top 0.305: U6.45 100.49,117.59 99.84,116.94 J9.4
  Top 0.508: J9.3 99.84,109.46 v99.9,109.4 | 25.2,76.8 32.7,84.3 58.2,84.3 v74.3,100.4
  Top 1.016: v99.9,109.4 100,109.4 | v74.3,100.4 v74.31,100.4
  Top 1.27: J9.4 J9.3
  Bottom 0.508: v99.9,109.4 99.2,110.1 76.2,110.1 74.3,108.2 v74.3,100.4
  Bottom 1.016: v99.9,109.4 100,109.4 | v74.3,100.4 v74.31,100.4
SSL0_A1_04  (via drill 0.35)
  Top 0.254: U2.126 25.25,74.96 26.01,75.72
  Top 0.305: U8.45 94.89,81.31 94.24,81.96 J14.4
  Top 0.508: 26.01,75.72 32.29,82 v75.1,82 | v86.5,82 88.86,82 J14.3
  Top 1.016: v86.5,82 v86.5,82.01 | v75.1,82 v75.1,82.01
  Top 1.27: J14.4 J14.3
  Bottom 0.508: v75.1,82 v86.5,82
  Bottom 1.016: v86.5,82 v86.5,82.01 | v75.1,82 75.1,81.9
SSL0_A1_05  (via drill 0.35)
  Top 0.254: U2.125 25.75,73.55 29.2,77
  Top 0.305: U10.45 94.89,44.71 94.24,45.36 J18.4
  Top 0.508: 29.2,77 32.6,80.4 71.5,80.4 74.4,77.5 v74.4,45.4 | 86.5,45.4 88.86,45.4 J18.3
  Top 1.016: v74.4,45.4 v74.41,45.4 | v86.4,45.4 86.5,45.4
  Top 1.27: J18.4 J18.3
  Bottom 0.508: v74.4,45.4 v86.4,45.4
  Bottom 1.016: v74.4,45.4 v74.4,45.39 | v86.4,45.4 v86.4,45.41
SSL0_A1_06  (via drill 0.35)
  Top 0.305: U12.45 94.89,13.03 94.24,13.68 J22.4 | U2.122 27.25,70.55 28.1,71.4 29,71.4 30.6,73 30.6,75.1 34.69,79.19 67.11,79.19 70.6,75.7 v70.6,13.7 | v86.6,13.7 88.88,13.7 J22.3
  Top 1.016: v86.6,13.7 v86.6,13.71 | v70.6,13.7 v70.61,13.7
  Top 1.27: J22.4 J22.3
  Bottom 0.508: v70.6,13.7 v86.6,13.7
  Bottom 1.016: v70.6,13.7 v70.6,13.71 | v86.6,13.7 v86.6,13.71
STEP_M0A1  (5 unrouted)
STEP_M1A1  (5 unrouted)
TCK  (6 unrouted)
  Top 0.254: U2.88 46.38,67.45
  Top 0.305: U1.32 11.81,120.99 7.68,125.12 J4.7 | U3.32 48.81,121.09 44.68,125.22 J6.7 | U6.32 89.71,121.09 85.58,125.22 J10.7 | U8.32 98.39,92.09 102.52,96.22 J15.7 | U10.32 98.39,55.49 102.52,59.62 J19.7 | U12.32 98.39,23.81 102.52,27.94 J23.7 | U2.88 59.65,67.45 62.92,70.72 J1.7
TDI  (6 unrouted)
  Top 0.305: U1.35 17.51,116.91 16.8,116.2 10.3,116.2 9,117.5 J4.1 | U3.35 54.51,117.11 53.7,116.3 47.3,116.3 46,117.6 J6.1 | U6.35 95.41,117.01 94.7,116.3 88.2,116.3 86.9,117.6 J10.1 | U8.35 94.01,86.39 93.6,86.8 93.6,93.6 94.9,94.9 J15.1 | U10.35 94.01,49.79 93.6,50.2 93.6,57 94.9,58.3 J19.1 | U12.35 94.01,18.11 93.6,18.52 93.6,25.32 94.9,26.62 J23.1 | U2.91 42.75,71.85 44.2,73.3 J1.1
TDO  (6 unrouted)
  Top 0.305: U1.34 17,117.7 16.4,117.1 12.3,117.1 9.36,120.04 J4.3 | U3.34 54,117.8 53.4,117.2 49.3,117.2 46.36,120.14 J6.3 | U6.34 94.9,117.8 94.3,117.2 90.2,117.2 87.26,120.14 J10.3 | U8.34 95.1,86.9 94.5,87.5 94.5,91.6 97.44,94.54 J15.3 | U10.34 95.1,50.3 94.5,50.9 94.5,55 97.44,57.94 J19.3 | U12.34 95.1,18.62 94.5,19.22 94.5,23.32 97.44,26.26 J23.3 | U2.90 43.25,70.65 44.3,71.7 57,71.7 57.84,72.54 J1.3
TMS  (6 unrouted)
  Top 0.15: 16.55,118.97 U1.33 | 53.55,119.07 U3.33 | 94.45,119.07 U6.33 | 96.37,87.35 U8.33 | 96.37,50.75 U10.33 | 96.37,19.07 U12.33
  Top 0.305: U1.33 16.49,118.39 16,117.9 13.6,117.9 8.92,122.58 J4.5 | U3.33 53.49,118.49 53,118 50.6,118 45.92,122.68 J6.5 | U6.33 94.39,118.49 93.9,118 91.5,118 86.82,122.68 J10.5 | U8.33 95.79,87.41 95.3,87.9 95.3,90.3 99.98,94.98 J15.5 | U10.33 95.79,50.81 95.3,51.3 95.3,53.7 99.98,58.38 J19.5 | U12.33 95.79,19.13 95.3,19.62 95.3,22.02 99.98,26.7 J23.5 | U2.89 43.75,69.95 44,70.2 58.1,70.2 60.38,72.48 J1.5
VBATT_M1A1  (5 unrouted)
VCL0_A1  (5 unrouted)
  Top 0.254: U1.5 22.08,131.89 23.79,133.6 C50.P$2 | U3.5 59.08,131.99 60.79,133.7 C65.P$2 | U6.5 99.98,131.99 101.69,133.7 C95.P$2 | U8.5 109.29,81.82 111,80.11 C125.P$2 | U10.5 109.29,45.22 111,43.51 C155.P$2 | U12.5 109.29,13.54 111,11.83 C185.P$2
VCL_F(FLASH)
  Top 0.305: U2.112 32.25,74.74 C7.P$2
VDD  (via drill 0.35)  (12 unrouted)
  Top 0.2: U2.149 20.3,59.43 | U2.110 33.23,69.39 | C14.P$2 | 16.99,54.69 C15.P$2
  Top 0.254: U2.61 v49.36,53.95 | U2.26 34.75,42.01 34.95,41.81 34.97,41.81 | U2.149 19.03,59.45 18.34,58.76 | 48.39,47.45 U2.48 | 34.97,41.81 34.25,42.53 U2.25 | C28.P$1 37.77,41.08 37.77,41.72 v38.27,42.22 37.87,41.81 34.97,41.81 | C31.P$1 v40.8,40.1 40.8,40.24 40.35,40.69 40.35,41.42 38.75,43.02 U2.34 | 15.72,48.52 C4.P$2 | 17.04,54.64 16.99,54.69 C15.P$2 | U2.123 26.74,69.39 26.74,71.84 v26.9,72 | C49.P$1 R5.P$2 | 15.4,134.07 C51.P$2 | C64.P$1 R6.P$2 | 52.4,134.17 C66.P$2 | C94.P$1 R8.P$2 | 93.3,134.17 C96.P$2 | C124.P$1 R10.P$2 | 111.47,88.5 C126.P$2 | C154.P$1 R13.P$2 | 111.47,51.9 C156.P$2 | C184.P$1 R15.P$2 | 111.47,20.22 C186.P$2
  Top 0.305: 12.4,122.53 C54.P$1 | U1.11 19.03,131.54 16.5,134.07 15.4,134.07 | C47.P$1 12.06,127.09 12.4,127.09 U1.20 | U1.29 v12.4,122.51 | U1.38 19.02,117 19.02,115.97 C43.P$1 | C52.P$1 C48.P$1 29.78,122.58 v28.7,122.01 U1.51 | C52.P$1 C53.P$1 | C53.P$1 C55.P$1 29.7,126.4 28.9,126.4 28.72,126.58 U1.60 | U1.56 28.35,124.55 28.6,124.2 | v28.7,124.2 29.69,124.2 C52.P$1 | U1.57 27.95,125.05 28.26,125.36 28.7,125.36 C53.P$1 | 49.4,122.64 C69.P$1 | U3.11 56.03,131.64 53.5,134.17 52.4,134.17 | C62.P$1 49.06,127.19 49.4,127.19 U3.20 | U3.29 v49.4,122.61 | U3.38 56.02,117.1 56.02,116.07 C61.P$1 | C67.P$1 C63.P$1 66.78,122.68 v65.7,122.11 U3.51 | C67.P$1 C68.P$1 | C68.P$1 C70.P$1 66.7,126.5 65.9,126.5 65.72,126.68 U3.60 | U3.56 65.35,124.65 65.6,124.3 | v65.7,124.3 66.69,124.3 C67.P$1 | U3.57 64.95,125.15 65.26,125.46 65.7,125.46 C68.P$1 | 90.3,122.64 C99.P$1 | U6.11 96.93,131.64 94.4,134.17 93.3,134.17 | C92.P$1 89.96,127.19 90.3,127.19 U6.20 | U6.29 v90.3,122.61 | U6.38 96.92,117.1 96.92,116.07 C91.P$1 | C97.P$1 C93.P$1 107.68,122.68 v106.6,122.11 U6.51 | C97.P$1 C98.P$1 | C98.P$1 C100.P$1 107.6,126.5 106.8,126.5 106.62,126.68 U6.60 | U6.56 106.25,124.65 106.5,124.3 | v106.6,124.3 107.59,124.3 C97.P$1 | U6.57 105.85,125.15 106.16,125.46 106.6,125.46 C98.P$1 | 99.94,91.5 C129.P$1 | U8.11 108.94,84.87 111.47,87.4 111.47,88.5 | C122.P$1 104.49,91.84 104.49,91.5 U8.20 | U8.29 v99.91,91.5 | U8.38 94.4,84.88 93.37,84.88 C121.P$1 | C127.P$1 C123.P$1 99.98,74.12 v99.41,75.2 U8.51 | C127.P$1 C128.P$1 | C128.P$1 C130.P$1 103.8,74.2 103.8,75 103.98,75.18 U8.60 | U8.56 101.95,75.55 101.6,75.3 | v101.6,75.2 101.6,74.21 C127.P$1 | U8.57 102.45,75.95 102.76,75.64 102.76,75.2 C128.P$1
  Top 0.305: 99.94,54.9 C159.P$1 | U10.11 108.94,48.27 111.47,50.8 111.47,51.9 | C152.P$1 104.49,55.24 104.49,54.9 U10.20 | U10.29 v99.91,54.9 | U10.38 94.4,48.28 93.37,48.28 C151.P$1 | C157.P$1 C153.P$1 99.98,37.52 v99.41,38.6 U10.51 | C157.P$1 C158.P$1 | C158.P$1 C160.P$1 103.8,37.6 103.8,38.4 103.98,38.58 U10.60 | U10.56 101.95,38.95 101.6,38.7 | v101.6,38.6 101.6,37.61 C157.P$1 | U10.57 102.45,39.35 102.76,39.04 102.76,38.6 C158.P$1 | 99.94,23.22 C189.P$1 | U12.11 108.94,16.59 111.47,19.12 111.47,20.22 | C182.P$1 104.49,23.56 104.49,23.22 U12.20 | U12.29 v99.91,23.22 | U12.38 94.4,16.6 93.37,16.6 C181.P$1 | C187.P$1 C183.P$1 99.98,5.84 v99.41,6.92 U12.51 | C187.P$1 C188.P$1 | C188.P$1 C190.P$1 103.8,5.92 103.8,6.72 103.98,6.9 U12.60 | U12.56 101.95,7.27 101.6,7.02 | v101.6,6.92 101.6,5.93 C187.P$1 | U12.57 102.45,7.67 102.76,7.36 102.76,6.92 C188.P$1 | U2.84 48.76,65.45 | 48.76,65.45 C6.P$1 | v48.76,66.36 48.76,65.45 | U2.138 v18.1,64.95 | 18,64.95 15.62,64.95 C14.P$2 | U2.154 v18.7,56.95 | U2.155 18.77,56.45 v18.32,56 | U2.158 17.26,54.95 16.99,54.69 | v17.61,48.45 U2.171 | v17.6,48.45 15.79,48.45 15.72,48.52 | C1.P$2 v33.25,71.95 U2.110 | C2.P$2 v39.7,71.7 39.75,71.65 U2.97 | v26.9,72 27.2,72.3 27.2,73.1 C3.P$2 | v48.42,47.42 50.03,47.42 C44.P$2
  Top 0.508: v16.15,7.2 R12.P$2 | v5.89,133.7 6.35,133.24 R5.P$2 | C43.P$1 18.35,115.3 4.81,115.3 4.54,115.57 | v42.89,133.8 43.35,133.34 R6.P$2 | C61.P$1 55.35,115.4 41.81,115.4 41.54,115.67 | v83.79,133.8 84.25,133.34 R8.P$2 | C91.P$1 96.25,115.4 82.71,115.4 82.44,115.67 | v111.1,98.01 110.64,97.55 R10.P$2 | C121.P$1 92.7,85.55 92.7,99.09 92.97,99.36 | v111.1,61.41 110.64,60.95 R13.P$2 | C151.P$1 92.7,48.95 92.7,62.49 92.97,62.76 | v111.1,29.73 110.64,29.27 R15.P$2 | C181.P$1 92.7,17.27 92.7,30.81 92.97,31.08 | C15.P$2 C46.P$2 | C46.P$2 C45.P$2 18.56,57.09 v18.7,56.95 | C23.P$2 v18.32,58.75 | C46.P$2 18.27,55.95 v18.32,56 | v49.36,53.95 49.38,53.97 C29.P$1 53.45,55.15 54.6,56.3 R3.P$2
  Top 1.016: v28.7,126.5 28.7,126.56 28.72,126.58 | v28.7,125.4 28.7,125.36 | v28.7,124.2 28.6,124.2 | J4.2 J4.4 4.53,120.07 | v65.7,126.6 65.7,126.66 65.72,126.68 | v65.7,125.5 65.7,125.46 | v65.7,124.3 65.6,124.3 | J6.2 J6.4 41.53,120.17 | v106.6,126.6 106.6,126.66 106.62,126.68 | v106.6,125.5 106.6,125.46 | v106.6,124.3 106.5,124.3 | J10.2 J10.4 82.43,120.17 | v103.9,75.2 103.96,75.2 103.98,75.18 | v102.8,75.2 102.76,75.2 | v101.6,75.2 101.6,75.3 | J15.2 J15.4 97.47,99.37 | v103.9,38.6 103.96,38.6 103.98,38.58 | v102.8,38.6 102.76,38.6 | v101.6,38.6 101.6,38.7 | J19.2 J19.4 97.47,62.77 | v103.9,6.92 103.96,6.92 103.98,6.9 | v102.8,6.92 102.76,6.92 | v101.6,6.92 101.6,7.02 | J23.2 J23.4 97.47,31.09 | v48.75,66.37 v48.76,66.36 | v40.8,40.1 v40.81,40.1 | v38.27,42.22 | v18.1,64.95 18,64.95 | v18.32,58.75 18.34,58.76 | v18.7,56.95 v18.71,56.95 | v18.32,56 v18.31,56 | v17.6,48.45 v17.61,48.45 | v26.9,72 v26.91,72 | v33.25,71.95 v33.26,71.95 | v39.7,71.7 v39.71,71.7 | v49.36,53.95 v49.37,53.95 | v48.42,47.42 48.39,47.45
  Top 1.27: v28.7,122.01 v28.71,122.01 | v19,117 19.02,117 | v12.4,122.51 12.4,122.53 | v12.4,127.1 12.4,127.09 | v5.89,133.7 v5.9,133.7 | 4.54,115.57 4.54,117.48 J4.2 | v65.7,122.11 v65.71,122.11 | v56,117.1 56.02,117.1 | v49.4,122.61 49.4,122.64 | v49.4,127.2 49.4,127.19 | v42.89,133.8 v42.9,133.8 | 41.54,115.67 41.54,117.58 J6.2 | v106.6,122.11 v106.61,122.11 | v96.9,117.1 96.92,117.1 | v90.3,122.61 90.3,122.64 | v90.3,127.2 90.3,127.19 | v83.79,133.8 v83.8,133.8 | 82.44,115.67 82.44,117.58 J10.2 | v99.41,75.2 v99.41,75.19 | v94.4,84.9 94.4,84.88 | v99.91,91.5 99.94,91.5 | v104.5,91.5 104.49,91.5 | v111.1,98.01 v111.1,98 | 92.97,99.36 94.88,99.36 J15.2 | v99.41,38.6 v99.41,38.59 | v94.4,48.3 94.4,48.28 | v99.91,54.9 99.94,54.9 | v104.5,54.9 104.49,54.9 | v111.1,61.41 v111.1,61.4 | 92.97,62.76 94.88,62.76 J19.2 | v99.41,6.92 v99.41,6.91 | v94.4,16.62 94.4,16.6 | v99.91,23.22 99.94,23.22 | v104.5,23.22 104.49,23.22 | v111.1,29.73 v111.1,29.72 | 92.97,31.08 94.88,31.08 J23.2 | v50.6,75.8 55.26,75.8 J1.2 J1.4
  Bottom 0.2: 24.7,58.75 24.85,58.75 24.9,58.8 | 24.85,56.95 24.9,57 | 41.1,65.6 40.9,65.8
  Bottom 0.254: 41.85,53.95 41.7,53.8 | 21.85,9 L2.2 23.15,8.9 | 21.25,8.9 20.65,8.9
  Bottom 0.508: C20.P$1 19.35,8 19.35,8.9 | C21.P$1 18.35,8 18.35,8.9 | C19.P$1 17.4,8.85 | 17.4,8.85 17.45,8.9 | 17.4,8.85 16.15,7.6 v16.15,7.2 | 1.76,121.04 1.7,121.1
  Bottom 0.813: L2.2 21.25,8.9 19.35,8.9 18.35,8.9 17.45,8.9
  Bottom 1.016: 24.9,65 24.9,58.8 24.9,57 24.9,53.8 40.1,53.8 | 24.9,65 25.7,65.8 26.9,65.8 | 26.9,65.8 33.25,65.8 | 33.25,65.8 39.7,65.8 | 39.7,65.8 40.9,65.8 | 40.1,53.8 41.7,53.8 49.21,53.8 v49.36,53.95 | 40.1,53.8 40.1,47.6 40.28,47.42 | v19,117 19,120.7 | v56,117.1 56,120.8 | v96.9,117.1 96.9,120.8 | v94.4,84.9 98.1,84.9 | v94.4,48.3 98.1,48.3 | v94.4,16.62 98.1,16.62 | v40.8,40.1 40.4,40.1 38.28,42.22 v38.27,42.22 38.27,45.41 40.28,47.42 | 40.28,47.42 v48.42,47.42 | v18.1,64.95 24.85,64.95 24.9,65 | v18.32,58.75 24.7,58.75 | 24.85,56.95 v18.7,56.95 18.32,56.58 v18.32,56 | 17.8,51.6 17.8,48.65 v17.6,48.45 | v33.25,71.95 33.25,65.8 | v39.7,71.7 39.7,65.8 | v12.4,127.1 14.05,128.75 14.05,128.95 | v12.4,122.51 16.39,122.51 16.5,122.4 | v49.4,127.2 51.1,128.9 51.1,129 | v49.4,122.61 53.39,122.61 53.5,122.5 | v90.3,127.2 91.95,128.85 91.95,129.05 | v90.3,122.61 94.29,122.61 94.4,122.5 | v104.5,91.5 106.2,89.8 106.2,89.7 | v99.91,91.5 99.91,87.51 99.8,87.4 | v104.5,54.9 106.2,53.2 106.3,53.2 | v99.91,54.9 99.91,50.91 99.8,50.8 | v104.5,23.22 106.24,21.48 106.24,21.46 | v99.91,23.22 99.91,19.23 99.8,19.12 | v26.9,72 26.9,65.8
  Bottom 1.27: v16.15,7.2 1.7,21.65 1.7,51.6 | 1.7,51.6 17.8,51.6 22.7,51.6 24.9,53.8 | 1.7,51.6 1.7,121.1 1.7,130.5 4.91,133.71 9.29,133.71 14.05,128.95 16.5,126.5 16.5,122.4 18.2,120.7 19,120.7 28,120.7 28.7,121.5 v28.7,126.5 36.01,133.81 46.29,133.81 51.1,129 53.5,126.6 53.5,122.5 55.2,120.8 56,120.8 65,120.8 65.7,121.6 v65.7,126.6 72.91,133.81 87.19,133.81 91.95,129.05 94.4,126.6 94.4,122.5 96.1,120.8 96.9,120.8 105.9,120.8 106.6,121.6 v106.6,126.6 | v103.9,6.92 98.9,6.92 98.1,7.62 98.1,16.62 98.1,17.42 99.8,19.12 103.9,19.12 106.24,21.46 111.11,26.33 111.11,31.39 v103.9,38.6 98.9,38.6 98.1,39.3 98.1,48.3 98.1,49.1 99.8,50.8 103.9,50.8 106.3,53.2 111.11,58.01 111.11,67.99 v103.9,75.2 98.9,75.2 98.1,75.9 98.1,84.9 98.1,85.7 99.8,87.4 103.9,87.4 106.2,89.7 111.11,94.61 111.11,117.6 v106.6,122.11 | 40.9,65.8 48.18,65.8 v48.75,66.37 50.6,68.22 v50.6,75.8
VDDIN  (1 unrouted)
  Bottom 1.016: J13.P$2 21.61,6.36 21.87,6.62
XCIN  (2 unrouted)
  Top 0.254: U2.20 31.74,44.02 31.74,42.31 33.05,41.01 33.05,39.65 32.44,39.05 | X3.P$1 31.53,37.26 31.84,37.57 31.84,38.17 32.44,38.77
XCIN_A1  (5 unrouted)
  Top 0.254: 21.57,130.7 U1.6 | 58.57,130.8 U3.6 | 99.47,130.8 U6.6 | 108.1,82.33 U8.6 | 108.1,45.73 U10.6 | 108.1,14.05 U12.6
  Top 0.305: X2.P$1 C39.P$1 23.81,135.47 22.22,133.88 22.22,133.25 21.57,132.6 21.57,130.7 | X5.P$1 C57.P$1 60.81,135.57 59.22,133.98 59.22,133.35 58.57,132.7 58.57,130.8 | X7.P$1 C87.P$1 101.71,135.57 100.12,133.98 100.12,133.35 99.47,132.7 99.47,130.8 | X9.P$1 C117.P$1 112.87,80.09 111.28,81.68 110.65,81.68 110,82.33 108.1,82.33 | X11.P$1 C147.P$1 112.87,43.49 111.28,45.08 110.65,45.08 110,45.73 108.1,45.73 | X13.P$1 C177.P$1 112.87,11.81 111.28,13.4 110.65,13.4 110,14.05 108.1,14.05
XCOUT  (1 unrouted)
  Top 0.254: U2.21 32.25,42.6 34.13,40.72 C11.P$1 34.13,38.34 33.15,37.35
XCOUT_A1  (5 unrouted)
  Top 0.152: X2.P$2 21.16,137.65 21.16,138.24 | X5.P$2 58.16,137.75 58.16,138.34 | X7.P$2 99.06,137.75 99.06,138.34 | X9.P$2 115.05,82.73 115.64,82.73 | X11.P$2 115.05,46.13 115.64,46.13 | X13.P$2 115.05,14.46 115.64,14.46
  Top 0.254: U1.7 21.06,134.25 C40.P$1 | U3.7 58.06,134.35 C58.P$1 | U6.7 98.96,134.35 C88.P$1 | U8.7 111.65,82.84 C118.P$1 | U10.7 111.65,46.24 C148.P$1 | U12.7 111.65,14.56 C178.P$1
  Top 0.305: C40.P$1 21.1,138.17 21.16,138.24 | C58.P$1 58.1,138.27 58.16,138.34 | C88.P$1 99,138.27 99.06,138.34 | C118.P$1 115.57,82.8 115.64,82.73 | C148.P$1 115.57,46.2 115.64,46.13 | C178.P$1 115.57,14.52 115.64,14.46
XTAL1  (3 unrouted)
  Top 0.254: U2.23 33.25,42.3 34.75,40.8 35.75,40.8 36.5,40.05 | 36.5,39 36.5,38.48 36.99,38 36.99,35.4 | 36.95,35.35 36.58,34.99 35.9,34.99
  Top 0.305: 36.5,40.05 C12.P$1
XTAL1_A1  (5 unrouted)
  Top 0.152: 18.65,135.3 C41.P$1 | 55.65,135.4 C59.P$1 | 96.55,135.4 C89.P$1 | 112.7,85.25 C119.P$1 | 112.7,48.65 C149.P$1 | 112.7,16.97 C179.P$1
  Top 0.254: 18.65,135.1 18.65,135.3 | 55.65,135.2 55.65,135.4 | 96.55,135.2 96.55,135.4 | 112.5,85.25 112.7,85.25 | 112.5,48.65 112.7,48.65 | 112.5,16.97 112.7,16.97
  Top 0.305: U1.9 20.05,132.7 18.65,134.1 18.65,135.1 | Y1.3 18.65,136.7 C41.P$1 | U3.9 57.05,132.8 55.65,134.2 55.65,135.2 | Y3.3 55.65,136.8 C59.P$1 | U6.9 97.95,132.8 96.55,134.2 96.55,135.2 | Y5.3 96.55,136.8 C89.P$1 | U8.9 110.1,83.85 111.5,85.25 112.5,85.25 | Y7.3 114.1,85.25 C119.P$1 | U10.9 110.1,47.25 111.5,48.65 112.5,48.65 | Y9.3 114.1,48.65 C149.P$1 | U12.9 110.1,15.57 111.5,16.97 112.5,16.97 | Y11.3 114.1,16.97 C179.P$1
XTAL2  (1 unrouted)
  Top 0.254: X4.3 38.1,36.9 38.1,38.62 37.83,38.88 C13.P$1 37.66,39.05 | 33.75,44 33.75,42.42 34.82,41.35 36,41.35 37.11,40.24 37.11,39.61
  Top 0.305: 37.11,39.61 37.82,38.9 C13.P$1
XTAL2_A1  (5 unrouted)
  Top 0.305: Y1.1 15.2,138.55 14.57,137.92 C42.P$1 16.1,135.51 19.54,132.07 U1.10 | Y3.1 52.2,138.65 51.57,138.02 C60.P$1 53.1,135.61 56.54,132.17 U3.10 | Y5.1 93.1,138.65 92.47,138.02 C90.P$1 94,135.61 97.44,132.17 U6.10 | Y7.1 115.95,88.7 115.32,89.33 C120.P$1 112.91,87.8 109.47,84.36 U8.10 | Y9.1 115.95,52.1 115.32,52.73 C150.P$1 112.91,51.2 109.47,47.76 U10.10 | Y11.1 115.95,20.42 115.32,21.05 C180.P$1 112.91,19.52 109.47,16.08 U12.10

## Text on the board
tPlace: 12.0 MHz | 32.768KHz | 12.0 MHz | 32.768KHz | 12.0 MHz | 32.768KHz | JTAG | JTAG | JTAG | Reset | Reset | Reset | TCK | TCK | TCK | TMS | TMS | TMS | TDO | TDO | TDO | TDI | TDI | TDI | JTAG | TDI | TDO | TMS | TCK | Reset | 12.0 MHz | 32.768KHz | JTAG | Reset | TDI | TDO | TMS | TCK | 12.0 MHz | 32.768KHz | JTAG | TDO | TMS | TCK | Reset | TDI | 12.0 MHz | 32.768KHz